# EAGLE design regulador 3v3 (EAGLE 6.3)
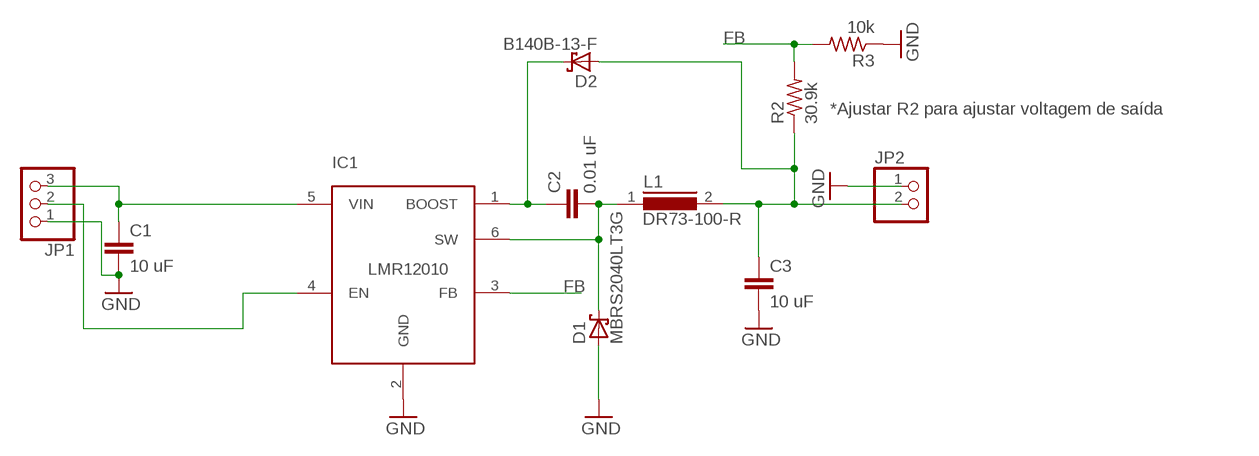
[diagram p0: schematic, sheet 1]

## Parts
C1  10 uF  C-EUC1210  [C1210]
C2  0.01 uF  C-EUC0805  [C0805]
C3  10 uF  C-EUC1210  [C1210]
D1  MBRS2040LT3G  MBRS130LT3  [SMB]
D2  B140B-13-F  MBRS130LT3  [SMB]
IC1  LMR12010  [SOT23-6L]
JP1  PINHD-1X3  [1X03]
JP2  PINHD-1X2  [1X02]
L1  DR73-100-R  DR73  [DR73]
R2  30.9k  R-US_R0805  [R0805]
R3  10k  R-US_R0805  [R0805]

## Nets
FB: IC1.3(FB) R2.2 R3.2
GND: C1.2 C3.2 D1.A IC1.2(GND) JP1.1 JP2.1 R3.1
N$1: IC1.4(EN) JP1.2
N$3: C2.1 D2.C IC1.1(BOOST)
N$4: C2.2 D1.C IC1.6(SW) L1.1
N$5: C3.1 D2.A JP2.2 L1.2 R2.1
VIN: C1.1 IC1.5(VIN) JP1.3

## Notes on the sheet
- *Ajustar R2 para ajustar voltagem de saída

## Library data of the parts
C1-C3 = rcl:C-EU: CAPACITOR, European symbol
D1 D2 = diode:MBRS130LT3: Schottky Power Rectifier Source: http://www.onsemi.com/pub/Collateral/MBRS130LT3-D.PDF
IC1 = national-semiconductor:LMR12010
JP1 = pinhead:PINHD-1X3: PIN HEADER
JP2 = pinhead:PINHD-1X2: PIN HEADER
L1 = inductors:DR73: High Power Density, High Efficiency, Shielded Inductors Source: coiltronics_dr_series.pdf
R2 R3 = rcl:R-US_: RESISTOR, American symbol

## Board
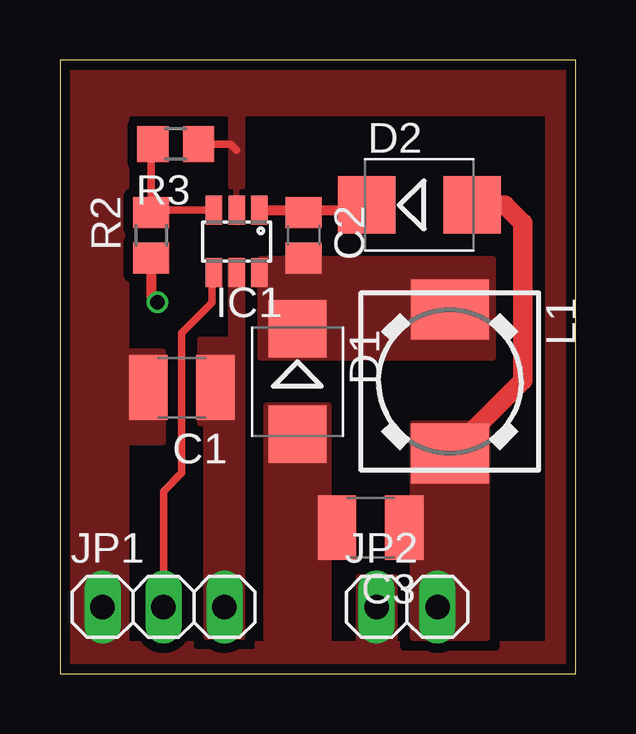
[diagram p1: board, top side]
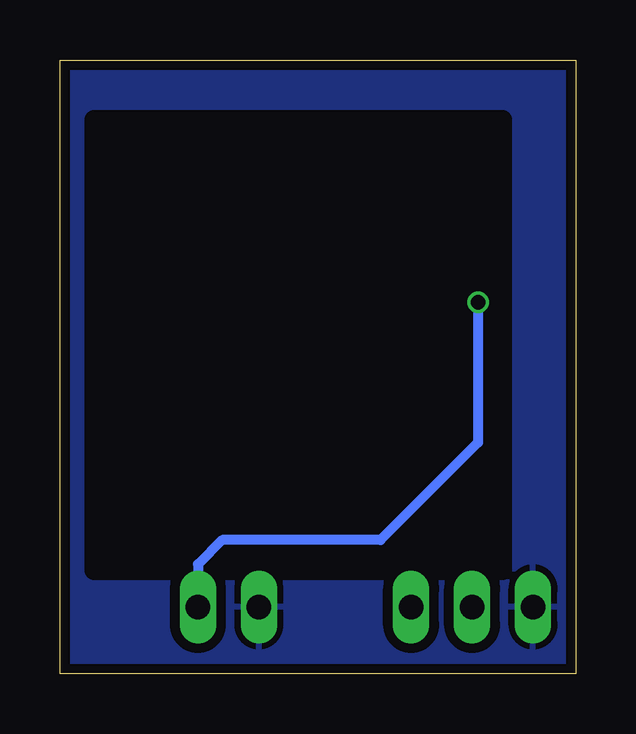
[diagram p2: board, bottom side, seen from below]

Size 21.5 x 25.6 mm. Coordinates in mm from the lower left corner, seen from the top.
Outline: 0,0 21.5,0 21.5,25.6 0,25.6 0,0
Copper layers (1*16): Top 0.035mm / dielectric 1.5mm / Bottom 0.035mm
Design rules "ITEADstudio_DRC": minimum track width 6mil, minimum drill 12mil, track to track 6mil, track to pad 6mil, pad to pad 6mil, via to via 6mil, smd to smd 0mil, copper to edge 10mil, drill to drill 10mil, minimum pad ring 10mil, minimum via ring 6mil, stop-mask expansion 2mil, vias tented up to drill 100mil, thermal gap 10mil
bRestrict: area 3,4.3 to 20.1,23.1

### Footprints (pad centres in the part's own frame; a part is rotated, then mirrored left to right if it is on the bottom)
C1210 = smd 1.6 x 2.7: 1 -1.4,0; 2 1.4,0
C0805 = smd 1.3 x 1.5: 1 -0.95,0; 2 0.95,0
SMB = smd 2.4 x 2.4: A 2.2,0; C -2.2,0
SOT23-6L = smd 0.69 x 1.2: 1 -0.95,-1.3; 2 0,-1.3; 3 0.95,-1.3; 4 0.95,1.3; 5 0,1.3; 6 -0.95,1.3
1X03 = drill 1.016 long: 1 -2.54,0; 2 0,0; 3 2.54,0
1X02 = drill 1.016 long: 1 -1.27,0; 2 1.27,0
DR73 = smd 2.5 x 3.25: 1 -3,0; 2 3,0
R0805 = smd 1.3 x 1.5: 1 -0.95,0; 2 0.95,0

### Placement (x,y rotation side)
C1  5.08,11.94 180 top
C2  10.16,18.29 270 top
C3  12.95,6.1 180 top
D1  9.91,12.19 270 top
D2  14.99,19.56 0 top
IC1  7.37,18.03 180 top
JP1  4.32,2.79 0 top
JP2  14.48,2.79 0 top
L1  16.26,12.19 270 top
R2  3.81,18.29 90 top
R3  4.83,22.1 180 top

### Tracks (layer width: path | path; a pad name or v marks a point on that pad's centre or on a via)
FB
  Top 0.305: IC1.3 3.91,19.33 R2.2 3.81,22.03 R3.2
GND
  Top 0.305: R3.1 7.11,22.1 7.37,21.84
  pour Top (isolate 0.406, no thermals): 11.18,0.25 11.18,11.18 8.64,11.18 8.64,0.25
  pour Top (isolate 0.406, rank 6, no thermals): 0,0 2.79,0 2.79,9.65 4.32,9.65 4.32,13.46 2.79,13.46 2.79,23.37 20.32,23.37 20.32,0 21.59,0 21.59,25.65 0,25.65
  pour Top (isolate 0.406): 7.11,18.8 7.11,23.62 7.62,23.62 7.62,18.8
  pour Top (isolate 0.406, rank 6, no thermals): 2.79,0.51 2.79,1.27 8.64,1.27 8.64,0.51
  pour Top (isolate 0.406, rank 6, no thermals): 11.18,0 11.18,1.27 20.32,1.27 20.32,0
  pour Bottom (isolate 0.406): 0,0 0,25.65 21.59,25.65 21.59,0
  pour Top (isolate 0.406, rank 6, no thermals): 12.45,1.02 12.45,4.06 13.97,4.06 13.97,1.02
N$1
  Top 0.305: JP1.2 4.32,7.62 5.08,8.38 5.08,14.22 6.35,15.49 6.35,16.67 IC1.4
N$3
  Top 0.305: 10.32,19.33 C2.1
  Top 0.406: IC1.1 10.06,19.33 C2.1 | 10.32,19.33 12.56,19.33 D2.C
N$4
  pour Top (isolate 0.406, no thermals): 8.38,17.27 8.38,13.21 18.03,13.21 18.03,17.27
N$5  (via drill 0.6)
  Top 0.406: R2.1 3.81,15.75 v4.06,15.49
  Top 0.813: D2.A 18.54,19.56 19.3,18.8 19.3,12.24 L1.2
  Bottom 0.406: v4.06,15.49 4.06,9.65 8.13,5.59 14.73,5.59 15.75,4.57 JP2.2
  pour Top (isolate 0.406, no thermals): 14.73,1.52 14.73,10.41 17.78,10.41 17.78,1.52
VIN
  pour Top (no thermals): 6.1,1.52 6.1,10.41 5.84,10.41 5.84,13.97 7.11,13.97 7.11,17.27 7.62,17.27 7.62,1.52